# EAGLE design AR-LCDONLY2 (EAGLE 7.6.0)
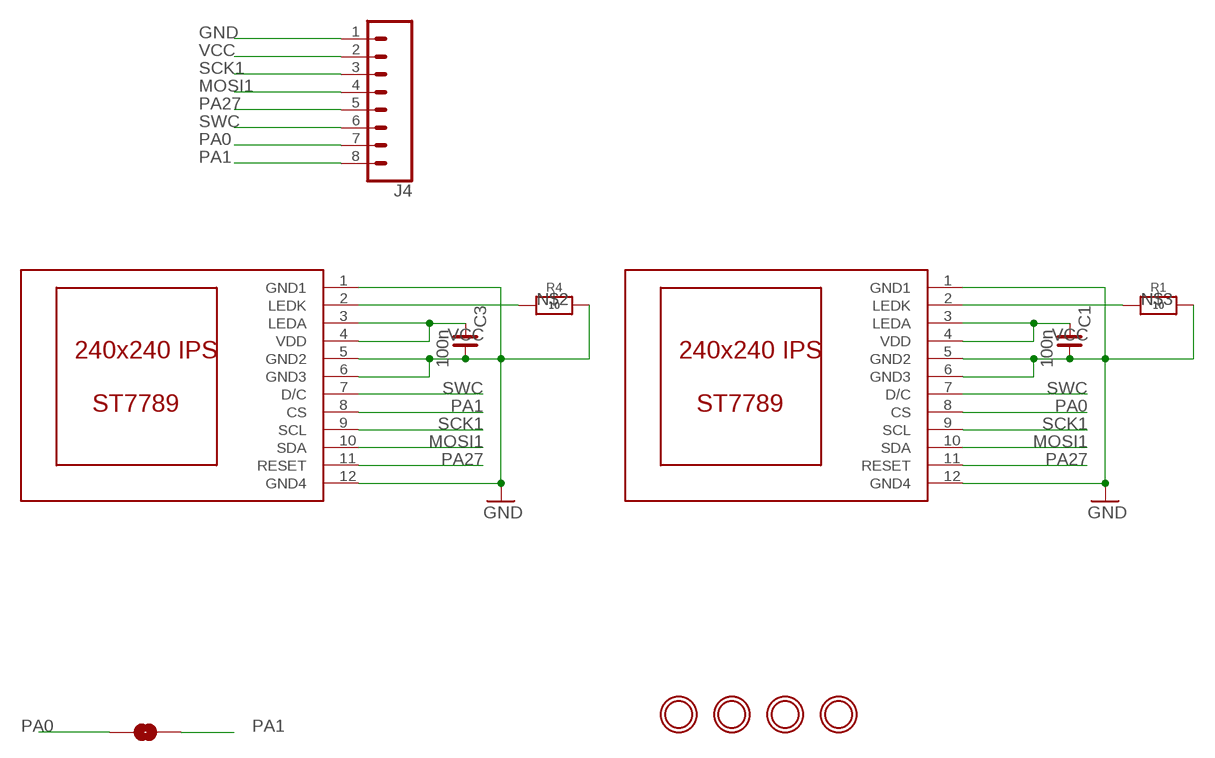
[diagram p0: schematic, sheet 1]

## Parts
C1  100n  C_0805  [C0805]
C3  100n  C_0805  [C0805]
J4  CONN_08LONGPADS  [1X08_LONGPADS]
JUMPER1  SOLDERJUMPERNC2  [SJ_2S-NOTRACE]
R1  10  RESISTOR_0805MP  [_0805MP]
R4  10  RESISTOR_0805MP  [_0805MP]
U$1  DISP_LCD_0.9IN_160X80  [TFT_0.96IN_160X80]
U$2  MOUNTINGHOLE2.0  [MOUNTINGHOLE_2.0_PLATED]
U$3  MOUNTINGHOLE2.0  [MOUNTINGHOLE_2.0_PLATED]
U$4  MOUNTINGHOLE2.0  [MOUNTINGHOLE_2.0_PLATED]
U$10  MOUNTINGHOLE2.0  [MOUNTINGHOLE_2.0_PLATED]
U$39  DISP_LCD_0.9IN_160X80  [TFT_0.96IN_160X80]

## Nets
GND [gnd]: C1.1 C3.1 J4.1 R1.2 R4.2 U$1.1(GND1) U$1.5(GND2) U$1.6(GND3) U$1.12(GND4) U$39.1(GND1) U$39.5(GND2) U$39.6(GND3) U$39.12(GND4)
MOSI1: J4.4 U$1.10(SDA) U$39.10(SDA)
N$2 [gnd]: R4.1 U$39.2(LEDK)
N$3 [gnd]: R1.1 U$1.2(LEDK)
PA0: J4.7 JUMPER1.2 U$1.8(CS)
PA1: J4.8 JUMPER1.1 U$39.8(CS)
PA27: J4.5 U$1.11(RESET) U$39.11(RESET)
SCK1: J4.3 U$1.9(SCL) U$39.9(SCL)
SWC: J4.6 U$1.7(D/C) U$39.7(D/C)
VCC: C1.2 C3.2 J4.2 U$1.3(LEDA) U$1.4(VDD) U$39.3(LEDA) U$39.4(VDD)

## Library data of the parts
C1 C3 = rc-master-smd:C_: NON-POLARIZED CAP
J4 = SparkFun-Connectors:CONN_08: Multi connection point. Often used as Generic Header-pin footprint for 0.1 inch spaced/style header connections On any of the 0.1 inch spaced packages, you can populate with these: Break Away Headers - Straight <https://www.sparkfun.com/products/116> (PRT-00116) Break Away Male Headers - Right Angle <https://www.sparkfun.com/products/553> (PRT-00553) Female Headers <https://www.sparkfun.com/products/115> (PRT-00115) Break Away Headers - Machine Pin <https://www.sparkfun.com/products/117> (PRT-00117) Break Away Female Headers - Swiss Machine Pin <https://www.sparkfun.com/products/743> (PRT-00743) Arduino Stackable Header - 8 Pin <https://www.sparkfun.com/products/9279> (PRT-09279) For SCREWTERMINALS and SPRING TERMINALS visit here: Screw Terimnals on SparkFun.com <https://www.sparkfun.com/search/results?term=Screw+Terminals> (5mm/3.5mm/2.54mm spacing) This device is also useful as a general connection point to wire up your design to another part of your project. Our various solder wires solder well into these plated through hole pads. Hook-Up Wire - Assortment (Stranded, 22 AWG) <https://www.sparkfun.com/products/11375> (PRT-11375) Hook-Up Wire - Assortment (Solid Core, 22 AWG) <https://www.sparkfun.com/products/11367> (PRT-11367) View the entire wire category on our website here <https://www.sparkfun.com/categories/141> Special notes: Molex polarized connector foot print use with SKU : PRT-08231 with associated crimp pins and housings. 1MM SMD Version SKU: PRT-10208 NOTES ON THE VARIANTS LOCK and LOCK_LONGPADS... This footprint was designed to help hold the alignment of a through-hole component (i.e. 6-pin header) while soldering it into place. You may notice that each hole has been shifted either up or down by 0.005 of an inch from it's more standard position (which is a perfectly straight line). This slight alteration caused the pins (the squares in the middle) to touch the edges of the holes. Because they are alternating, it causes a "brace" to hold the component in place. 0.005 has proven to be the perfect amount of "off-center" position when using our standard breakaway headers. Although looks a little odd when you look at the bare footprint, once you have a header in there, the alteration is very hard to notice. Also,if you push a header all the way into place, it is covered up entirely on the bottom side.
JUMPER1 = SparkFun:SOLDERJUMPER: Solder Jumper Standard SMD solder jumper. Used to automate production. Two varients : Normally Open and Normally Closed are the same, but have different paste layers. NC will have a large amount of paste and should jumper during reflow.
R1 R4 = microbuilder:RESISTOR: Resistors For new designs, use the packages preceded by an '_' character since they are more reliable: The following footprints should be used on most boards: _0402 - Standard footprint for regular board layouts _0603 - Standard footprint for regular board layouts _0805 - Standard footprint for regular board layouts _1206 - Standard footprint for regular board layouts For extremely tight-pitch boards where space is at a premium, the following 'micro-pitch' footprints can be used (smaller pads, no silkscreen outline, etc.): _0402MP - Micro-pitch footprint for very dense/compact boards _0603MP - Micro-pitch footprint for very dense/compact boards _0805MP - Micro-pitch footprint for very dense/compact boards _1206MP - Micro-pitch footprint for very dense/compact boards
U$1 U$39 = ips096:DISP_LCD_0.9IN_160X80
U$2-U$4 U$10 = microbuilder:MOUNTINGHOLE: Mounting Hole For #2 screws (0.086"/2.18mm width, 0.094"/2.4mm hole) use 2.5mm; BOM: EXCLUDE

## Net classes
0 vcc: width 0.203 mm, drill 0.356 mm, clearance 0.254 mm
1 gnd: width 0.203 mm, drill 0.356 mm, clearance 0.254 mm
2 xxx: width 0.203 mm, drill 0.356 mm, clearance 0.254 mm

## Board
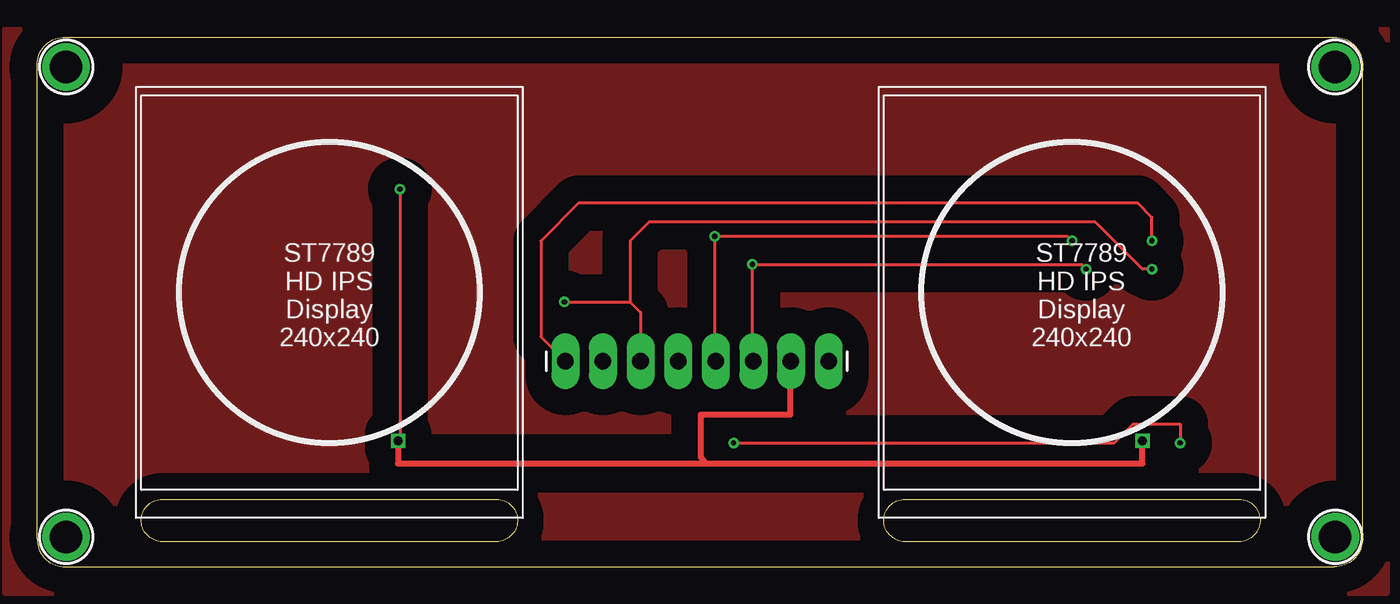
[diagram p1: board, top side]
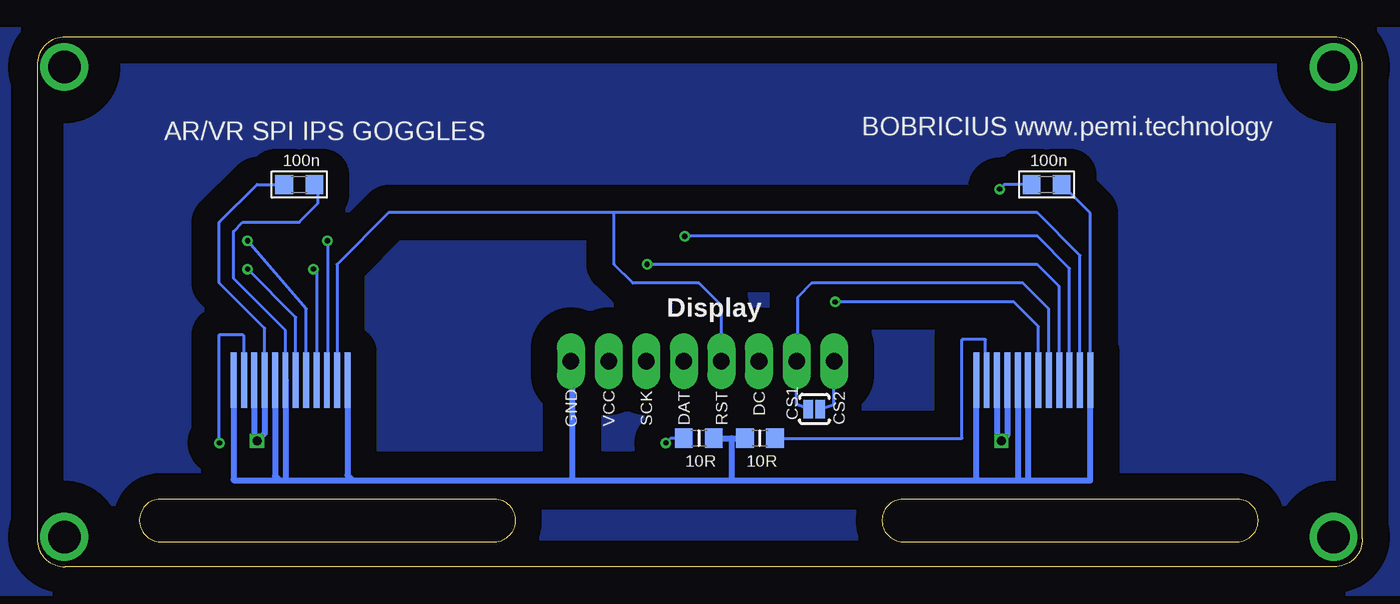
[diagram p2: board, bottom side, seen from below]

Size 89.53 x 35.81 mm. Coordinates in mm from the lower left corner, seen from the top.
Outline: 1.91,0 87.63,0 arc90 89.53,1.91 89.53,33.91 arc90 87.63,35.81 1.91,35.81 arc90 0,33.91 0,1.91 arc90 1.91,0
Outline: 31.18,4.57 arc-167 31.18,1.71 8.32,1.71 arc-167 8.32,4.57 31.18,4.57
Outline: 81.34,4.57 arc-167 81.34,1.71 58.48,1.71 arc-167 58.48,4.57 81.34,4.57
Copper layers (1*16): Top 0.0356mm / dielectric 1.5011mm / Bottom 0.0356mm
Design rules "LaenPCBOrder *": minimum track width 6mil, minimum drill 13mil, track to track 6mil, track to pad 6mil, pad to pad 6mil, via to via 6mil, smd to smd 6mil, copper to edge 15mil, drill to drill 6mil, minimum pad ring 7mil, minimum via ring 7mil, stop-mask expansion 4mil, vias tented up to drill 30mil, thermal gap 10mil

### Footprints (pad centres in the part's own frame; a part is rotated, then mirrored left to right if it is on the bottom)
C0805 = smd 1.2 x 1.3: 1 -1.016,0; 2 1.016,0
1X08_LONGPADS = drill 1.118 pad 1.88 long: 1 0,0; 2 2.54,0; 3 5.08,0; 4 7.62,0; 5 10.16,0; 6 12.7,0; 7 15.24,0; 8 17.78,0
SJ_2S-NOTRACE = smd 0.635 x 1.27: 1 -0.401,0; 2 0.413,0
_0805MP = smd 1.2 x 1.3: 1 -1.016,0; 2 1.016,0
TFT_0.96IN_160X80 = smd 3.74 x 0.4 bottom: 1 19.25,20.311; 2 19.25,19.611; 3 19.25,18.911; 4 19.25,18.211; 5 19.25,17.511; 6 19.25,16.811; 7 19.25,16.111; 8 19.25,15.411; 9 19.25,14.711; 10 19.25,14.011; 11 19.25,13.311; 12 19.25,12.611
MOUNTINGHOLE_2.0_PLATED = drill 2.2 pad 3: P$1 0,0

### Placement (x,y rotation side)
C1  71.82,25.84 180 bottom
C3  21.34,25.84 180 bottom
J4  53.47,13.91 180 top
JUMPER1  37.02,10.67 180 bottom
R1  40.7,8.7 180 bottom
R4  44.83,8.7 0 bottom
U$1  5.78,31.88 270 top
U$2  87.69,2.03 0 top
U$3  87.69,33.78 0 top
U$4  1.97,33.78 0 top
U$10  1.97,2.03 0 top
U$39  55.94,31.88 270 top

### Tracks (layer width: path | path; a pad name or v marks a point on that pad's centre or on a via)
GND
  Bottom 0.203: U$1.12 18.39,23.91 C3.1 | U$39.6 72.75,15.99 76.26,19.49 76.26,22.67 75.63,23.3 71.82,23.3 70.55,24.58 70.55,25.59 C1.1
  Bottom 0.406: 73.15,5.84 76.2,5.84 76.25,5.9 U$39.1 | 73.15,5.84 72.77,5.84 | 72.77,5.84 68.2,5.84 | 68.2,5.84 53.4,5.84 | 53.4,5.84 42.61,5.84 | 42.61,5.84 26.09,5.84 | 26.09,5.84 23.29,5.84 | 23.29,5.84 22.59,5.84 | 22.59,5.84 18.39,5.84 U$1.12 | U$1.6 22.59,5.84 | U$1.5 23.29,5.84 | 26.09,5.84 U$1.1 | U$39.5 73.45,6.14 73.15,5.84 | U$39.6 72.75,5.86 72.77,5.84 | U$39.12 68.55,6.2 68.2,5.84 | J4.1 53.4,13.91 53.4,5.84 | R4.2 42.61,8.7 | 42.61,8.7 R1.2 | 42.61,8.7 42.61,5.84
MOSI1  (via drill 0.36)
  Top 0.203: v69.91,22.03 69.6,22.35 v45.78,22.35 45.78,13.97 J4.4
  Bottom 0.203: U$1.10 19.79,20.17 21.97,22.35 v45.78,22.35 | v69.91,22.03 69.91,12.67 U$39.10
N$1
  pour Top (isolate 1.778): -2.16,36.32 91.19,36.32 91.19,-1.78 -2.16,-1.78
  pour Bottom (isolate 1.778): 92.46,36.32 -4.06,36.32 -4.06,-1.78 92.46,-1.78
N$2  (via drill 0.36)
  Top 0.203: v47.05,8.38 72.77,8.38 74.04,9.65 77.22,9.65 v77.22,8.38
  Bottom 0.203: R4.1 46.74,8.7 v47.05,8.38 | v77.22,8.38 77.22,15.69 75.63,15.69 75.55,15.61 U$39.2
N$3
  Bottom 0.203: R1.1 27.05,8.7 27.05,15.37 25.46,15.37 25.46,12.63 U$1.2
PA0
  Bottom 0.203: JUMPER1.2 38.23,10.99 J4.7 38.16,13.97 38.16,18.22 37.21,19.18 22.92,19.18 21.19,17.44 U$1.8
PA1  (via drill 0.36)
  Top 0.203: v75.31,22.03 75.31,23.62 74.36,24.58 36.58,24.58 34.04,22.03 34.04,15.56 J4.8
  Bottom 0.203: JUMPER1.1 35.69,10.99 J4.8 | U$39.8 71.35,17.44 v75.31,22.03
PA27
  Bottom 0.203: U$1.11 19.09,21.06 21.97,23.94 50.55,23.94 | 50.55,23.94 65.79,23.94 69.28,20.45 69.28,12.65 U$39.11 | J4.5 43.31,17.65 44.83,19.18 49.28,19.18 50.55,20.45 50.55,23.94
SCK1  (via drill 0.36)
  Top 0.203: v70.87,20.13 70.55,20.45 v48.32,20.45 48.32,13.97 J4.3
  Bottom 0.203: U$1.9 20.49,18.96 21.97,20.45 v48.32,20.45 | v70.87,20.13 70.65,19.92 U$39.9
SWC  (via drill 0.36)
  Top 0.203: v35.62,17.91 40.07,17.91 | 40.07,17.91 40.77,17.21 J4.6 | v75.31,20.13 74.68,20.13 71.5,23.3 41.34,23.3 40.07,22.03 40.07,17.91
  Bottom 0.203: U$1.7 21.89,16.24 23.56,17.91 v35.62,17.91 | U$39.7 72.05,16.87 v75.31,20.13
VCC  (via drill 0.36, 0.6)
  Top 0.203: v24.51,25.53 24.51,8.64 v24.38,8.51
  Top 0.406: v24.38,8.51 24.38,6.98 45.15,6.98 | 45.15,6.98 74.68,6.98 v74.68,8.51 | J4.2 50.86,13.91 50.86,10.29 44.83,10.29 44.83,7.43 45.15,6.98
  Bottom 0.203: U$39.4 74.15,16.12 77.22,19.18 77.22,23.3 74.68,25.84 C1.2 | C3.2 24.19,25.84 v24.51,25.53
  Bottom 0.406: U$39.3 74.85,8.69 v74.68,8.51 74.15,9.03 U$39.4 | U$1.3 24.69,8.81 v24.38,8.51 23.99,8.9 U$1.4

### Text on the board
tNames: ST7789 / HD IPS / Display / 240x240 | ST7789 / HD IPS / Display / 240x240
bNames: BOBRICIUS www.pemi.technology | AR/VR SPI IPS GOGGLES | 100n | 100n | Display | CS2 | CS1 | DC | RST | DAT | SCK | VCC | GND | 10R | 10R